# EAGLE schematic Preselector (EAGLE 7.7.0)

## Sheet 1 of 5: POWER SYSTEM
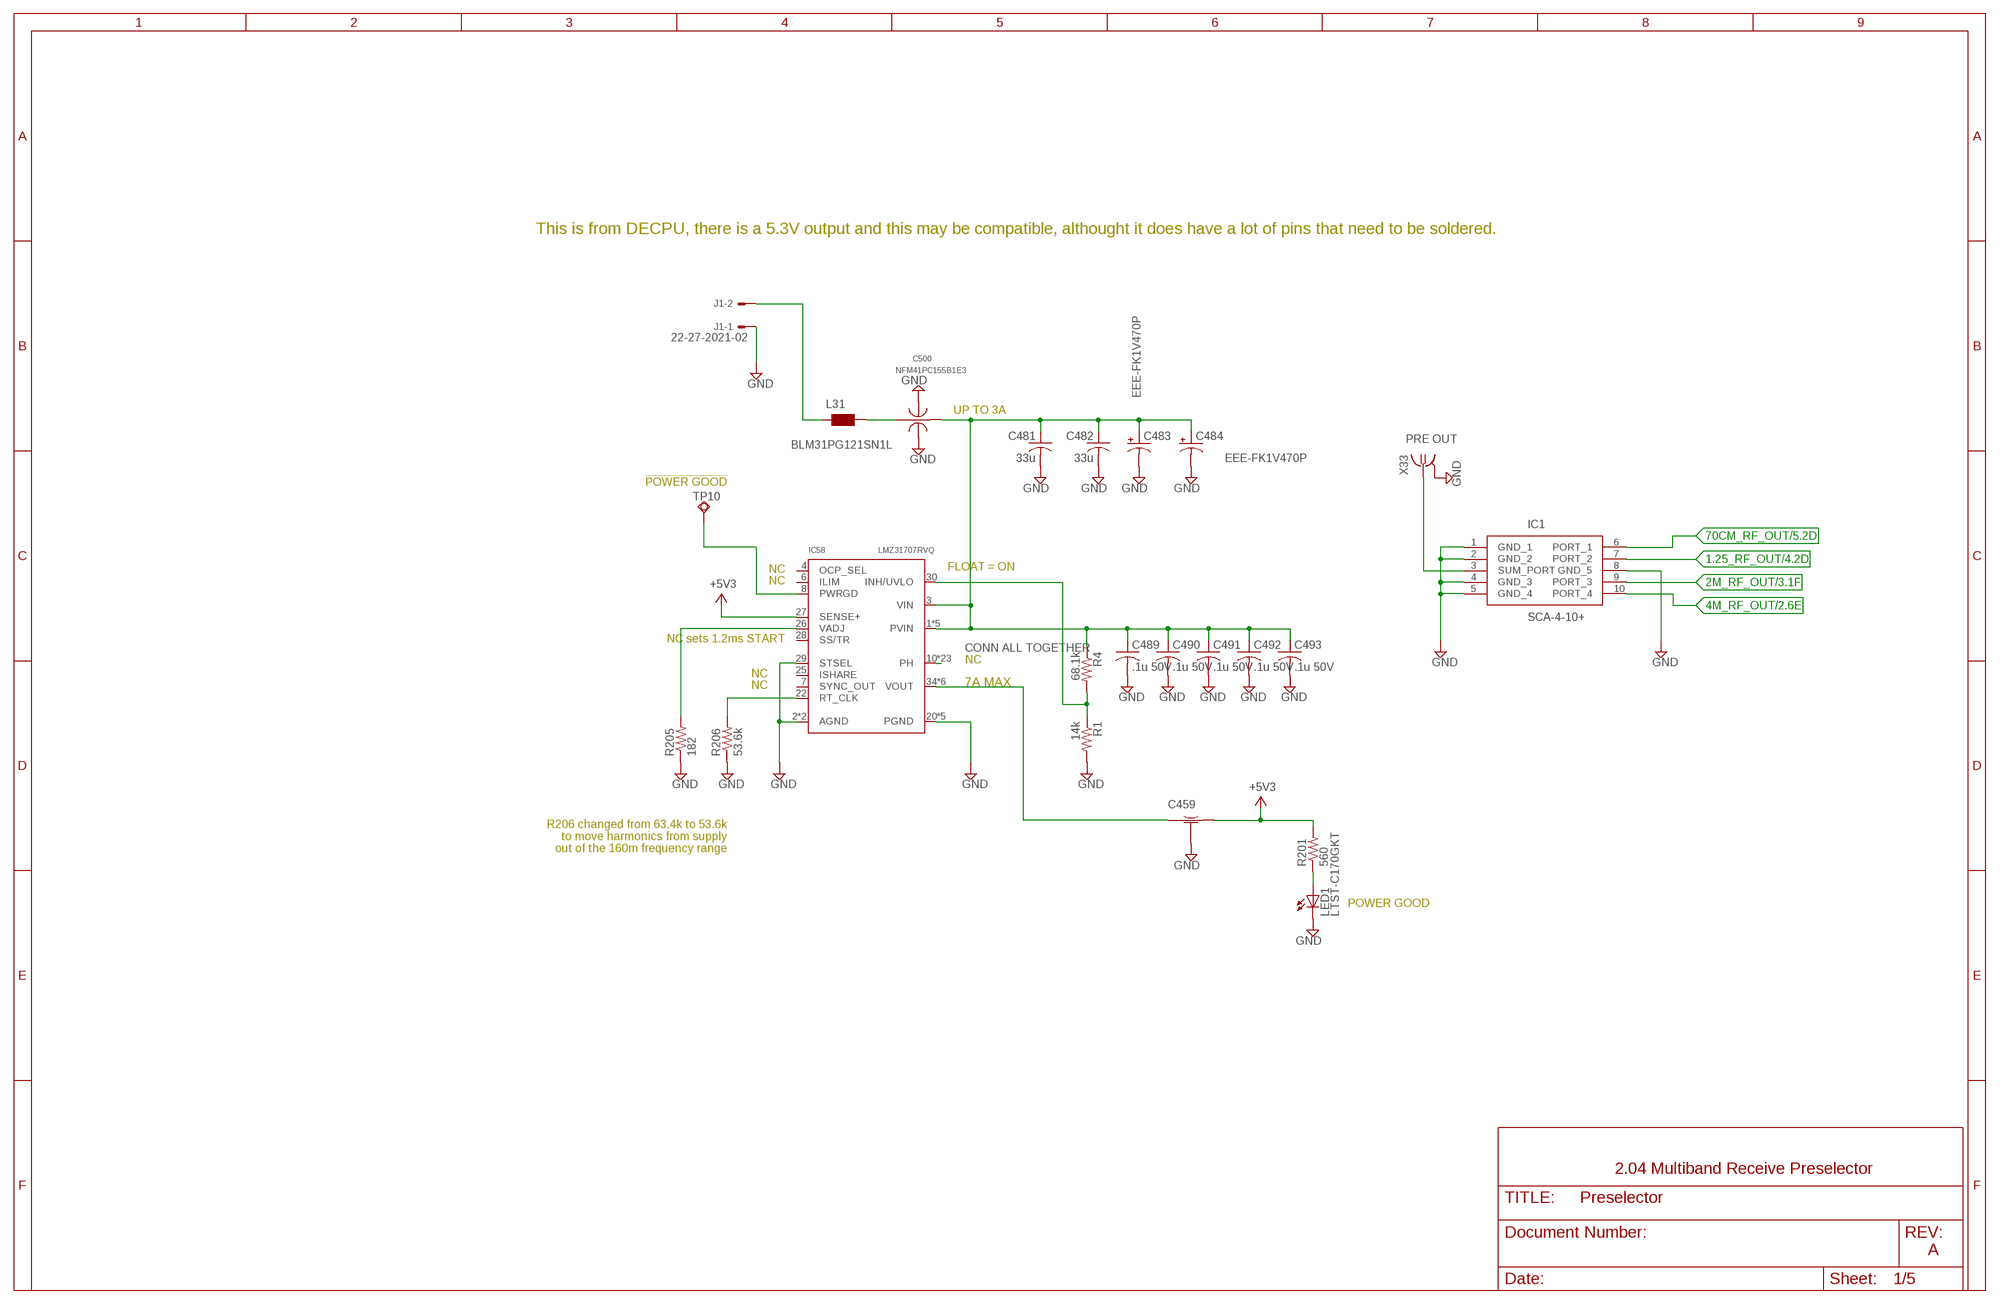
[diagram p0: schematic, sheet 1]

### Parts
C459  NFM31PC276B0J3L  [NFM31PC276]
C481  33u  C-USC1206K  [C1206K]
C482  33u  C-USC1206K  [C1206K]
C483  EEE-FK1V470P  CPOL-USD  [PANASONIC_D]
C484  EEE-FK1V470P  CPOL-USD  [PANASONIC_D]
C489  .1u 50V  C-USC0603K  [C0603K]
C490  .1u 50V  C-USC0603K  [C0603K]
C491  .1u 50V  C-USC0603K  [C0603K]
C492  .1u 50V  C-USC0603K  [C0603K]
C493  .1u 50V  C-USC0603K  [C0603K]
C500  NFM41PC155B1E3  [NFM1806]
IC1  SCA-4-10+  [SCA-4-10+]
IC58  LMZ31707RVQ  [RVQ]
J1  22-27-2021-02  [6410-02]
L31  BLM31PG121SN1L  WE-CBF_1206  [1206]
LED1  LTST-C170GKT  LEDCHIPLED_0805  [CHIPLED_0805]
R1  14k  R-US_R0603  [R0603]
R4  68.1k  R-US_R0603  [R0603]
R201  560  R-US_R0603  [R0603]
R205  182  R-US_R0603  [R0603]
R206  53.6k  R-US_R0603  [R0603]
TP10  TPSQB1,27  [B1,27]
X33  0733660061  BU-SMA-V  [BU-SMA-V]

### Nets
1.25_RF_OUT: IC1.7(PORT_2) ; also sheet 4
2M_RF_OUT: IC1.9(PORT_3) ; also sheet 3
4M_RF_OUT: IC1.10(PORT_4) ; also sheet 2
70CM_RF_OUT: IC1.6(PORT_1) ; also sheet 5
+5V3: C459.OUT IC58.27(SENSE+) R201.2 ; also sheet 2,3,4,5
+13.8V_SW_FIL: C481.1 C482.1 C483.+ C484.+ C489.1 C490.1 C491.1 C492.1 C493.1 C500.2(OUT) IC58.1(PVIN) IC58.3(VIN) IC58.11(PVIN) IC58.12(PVIN) IC58.39(PVIN) IC58.40(PVIN) R4.1
+13.8V_TPS: J1.2 L31.1
GND [GND]: C459.GND1(GND) C459.GND2(GND) C459.GND3(GND) C459.GND4(GND) C459.GND5(GND) C481.2 C482.2 C483.- C484.- C489.2 C490.2 C491.2 C492.2 C493.2 C500.GND@1(GND) C500.GND@2(GND) IC1.1(GND_1) IC1.2(GND_2) IC1.4(GND_3) IC1.5(GND_4) IC1.8(GND_5) IC58.2(AGND) IC58.20(PGND) IC58.21(PGND) IC58.23(AGND) IC58.29(STSEL) IC58.31(PGND) IC58.32(PGND) IC58.33(PGND) J1.1 LED1.C R1.2 R205.1 R206.1 X33.2(GND) ; also sheet 2,3,4,5
N$169: C500.1(IN) L31.2
N$178: IC58.30(INH/UVLO) R1.1 R4.2
N$180: IC58.8(PWRGD) TP10.TP
N$191: IC58.22(RT_CLK) R206.2
N$193: IC58.26(VADJ) R205.2
N$196: C459.IN IC58.34(VOUT) IC58.35(VOUT) IC58.36(VOUT) IC58.37(VOUT) IC58.38(VOUT) IC58.41(VOUT)
N$213: LED1.A R201.1
PH: IC58.10(PH) IC58.13(PH) IC58.14(PH) IC58.15(PH) IC58.16(PH) IC58.17(PH) IC58.18(PH) IC58.19(PH) IC58.42(PH) IC58.42A(PH) IC58.42B(PH) IC58.42C(PH) IC58.42D(PH) IC58.42E(PH) IC58.42F(PH) IC58.42G(PH) IC58.42H(PH) IC58.42J(PH) IC58.42K(PH) IC58.42L(PH) IC58.42M(PH) IC58.42N(PH) IC58.42P(PH)
PRE_OUT: IC1.3(SUM_PORT) X33.1
Unconnected: IC58.4(OCP_SEL) IC58.6(ILIM) IC58.7(SYNC_OUT) IC58.25(ISHARE) IC58.28(SS/TR)

### Notes on the sheet
- This is from DECPU, there is a 5.3V output and this may be compatible, althought it does have a lot of pins that need to be soldered.
- UP TO 3A
- PRE OUT
- !POWER GOOD
- NC
- FLOAT = ON
- NC
- NC sets 1.2ms START
- CONN ALL TOGETHER
- NC
- NC
- NC
- 7A MAX
- R206 changed from 63.4k to 53.6k
  to move harmonics from supply
  out of the 160m frequency range
- POWER GOOD
- 2.04 Multiband Receive Preselector
- A

## Sheet 2 of 5: 4m Band
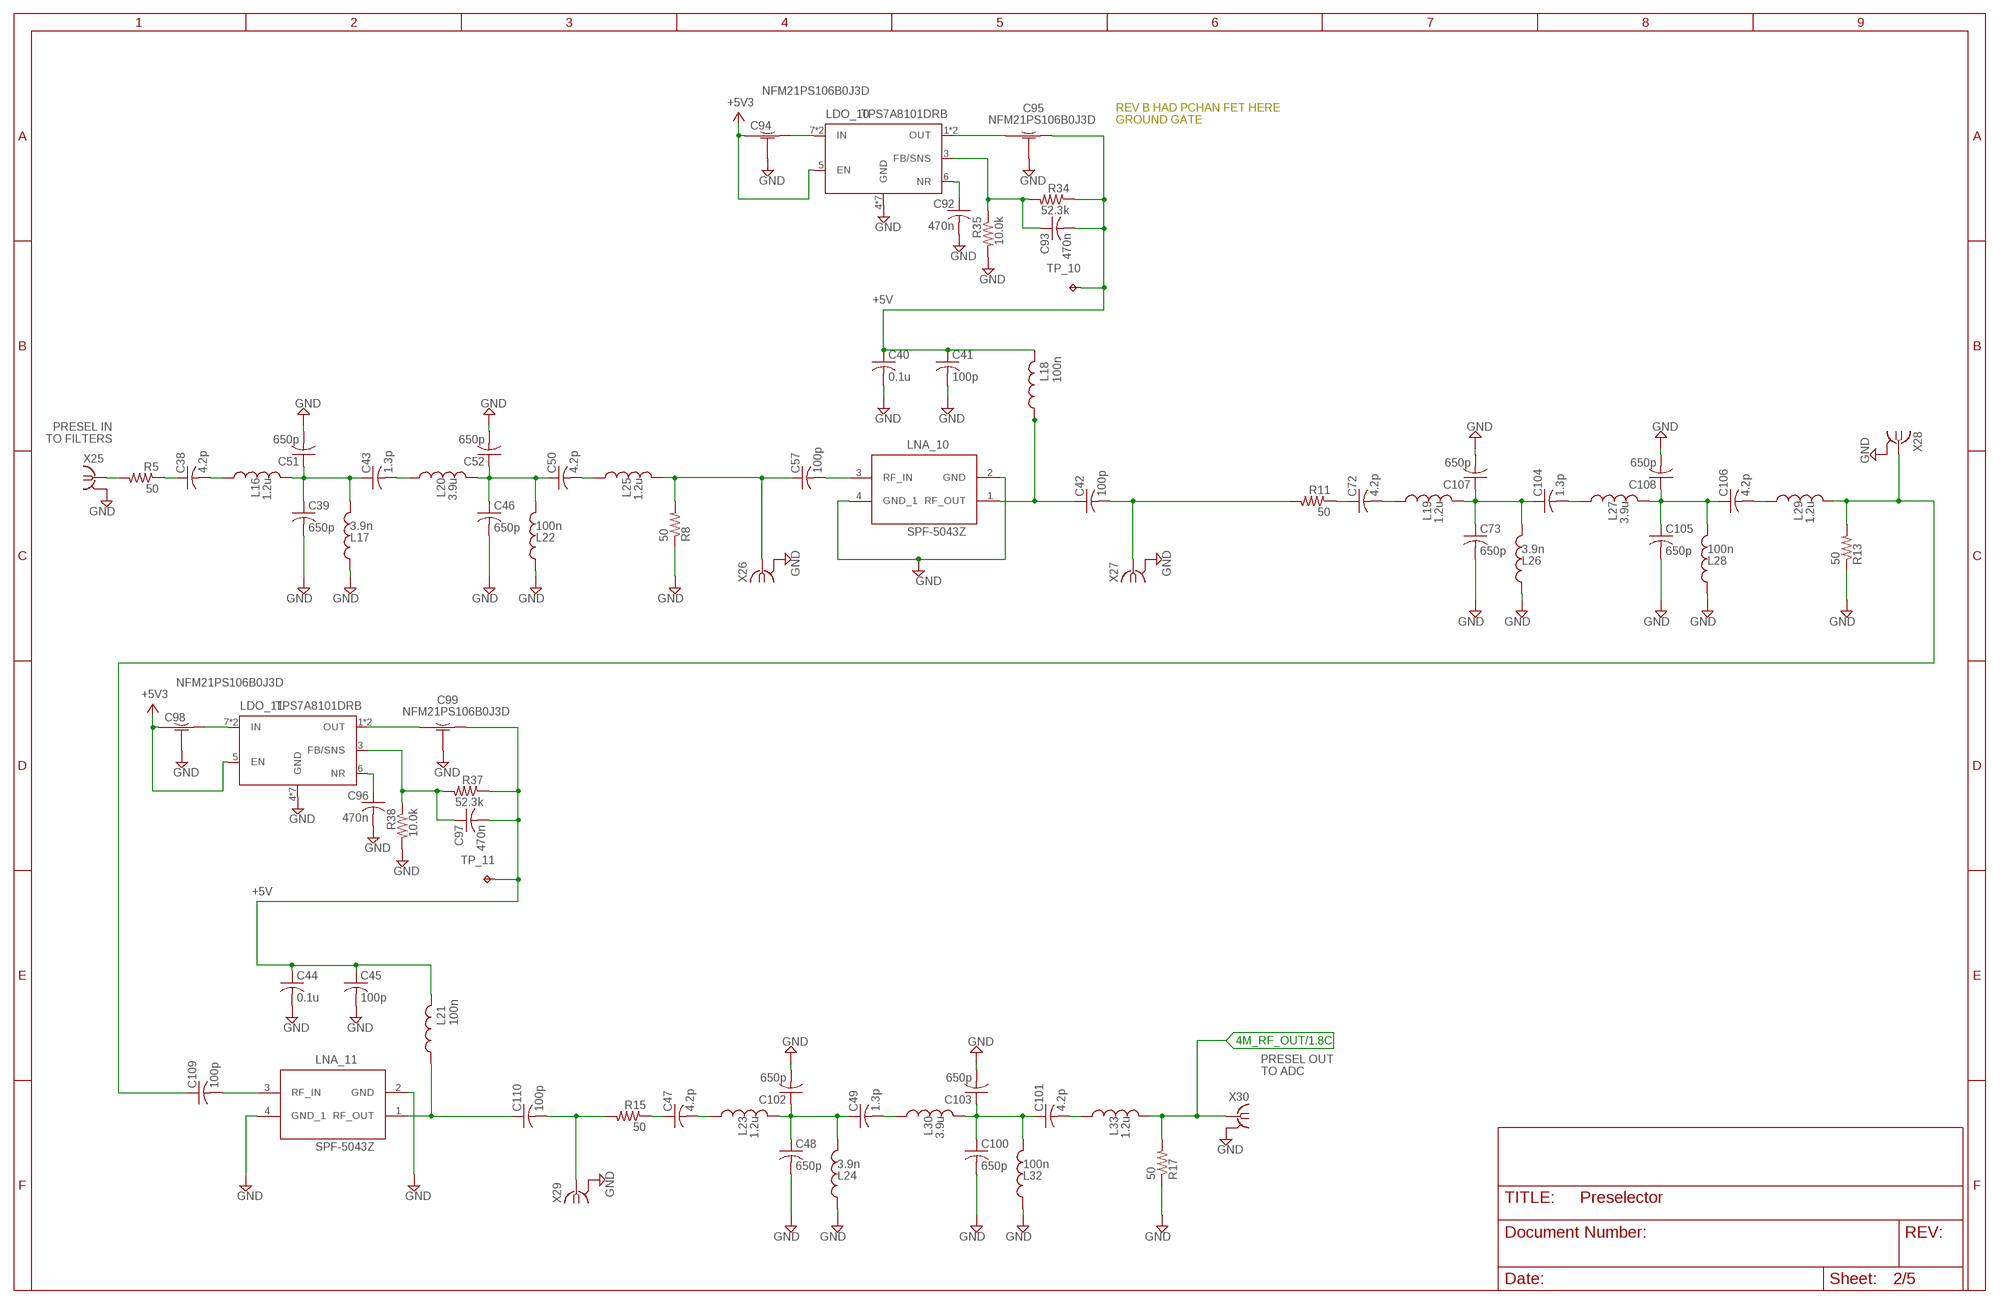
[diagram p1: schematic, sheet 2]

### Parts
C38  4.2p  C-USC0603K  [C0603K]
C39  650p  C-USC0603K  [C0603K]
C40  0.1u  C-USC0603K  [C0603K]
C41  100p  C-USC0603K  [C0603K]
C42  100p  C-USC0603K  [C0603K]
C43  1.3p  C-USC0603K  [C0603K]
C44  0.1u  C-USC0603K  [C0603K]
C45  100p  C-USC0603K  [C0603K]
C46  650p  C-USC0603K  [C0603K]
C47  4.2p  C-USC0603K  [C0603K]
C48  650p  C-USC0603K  [C0603K]
C49  1.3p  C-USC0603K  [C0603K]
C50  4.2p  C-USC0603K  [C0603K]
C51  650p  C-USC0603K  [C0603K]
C52  650p  C-USC0603K  [C0603K]
C57  100p  C-USC0603K  [C0603K]
C72  4.2p  C-USC0603K  [C0603K]
C73  650p  C-USC0603K  [C0603K]
C92  470n  C-USC0603K  [C0603K]
C93  470n  C-USC0603K  [C0603K]
C94  NFM21PS106B0J3D  NFM21PS  [NFM21PS]
C95  NFM21PS106B0J3D  NFM21PS  [NFM21PS]
C96  470n  C-USC0603K  [C0603K]
C97  470n  C-USC0603K  [C0603K]
C98  NFM21PS106B0J3D  NFM21PS  [NFM21PS]
C99  NFM21PS106B0J3D  NFM21PS  [NFM21PS]
C100  650p  C-USC0603K  [C0603K]
C101  4.2p  C-USC0603K  [C0603K]
C102  650p  C-USC0603K  [C0603K]
C103  650p  C-USC0603K  [C0603K]
C104  1.3p  C-USC0603K  [C0603K]
C105  650p  C-USC0603K  [C0603K]
C106  4.2p  C-USC0603K  [C0603K]
C107  650p  C-USC0603K  [C0603K]
C108  650p  C-USC0603K  [C0603K]
C109  100p  C-USC0603K  [C0603K]
C110  100p  C-USC0603K  [C0603K]
L16  1.2u  L-US0603  [C0603K]
L17  3.9n  L-US0603  [C0603K]
L18  100n  L-US1206  [C1206]
L19  1.2u  L-US0603  [C0603K]
L20  3.9u  L-US0603  [C0603K]
L21  100n  L-US1206  [C1206]
L22  100n  L-US0603  [C0603K]
L23  1.2u  L-US0603  [C0603K]
L24  3.9n  L-US0603  [C0603K]
L25  1.2u  L-US0603  [C0603K]
L26  3.9n  L-US0603  [C0603K]
L27  3.9u  L-US0603  [C0603K]
L28  100n  L-US0603  [C0603K]
L29  1.2u  L-US0603  [C0603K]
L30  3.9u  L-US0603  [C0603K]
L32  100n  L-US0603  [C0603K]
L33  1.2u  L-US0603  [C0603K]
LDO_10  TPS7A8101DRB  [DRB]
LDO_11  TPS7A8101DRB  [DRB]
LNA_10  SPF-5043Z  [SPF-5043Z]
LNA_11  SPF-5043Z  [SPF-5043Z]
R5  50  R-US_R0603  [R0603]
R8  50  R-US_R0603  [R0603]
R11  50  R-US_R0603  [R0603]
R13  50  R-US_R0603  [R0603]
R15  50  R-US_R0603  [R0603]
R17  50  R-US_R0603  [R0603]
R34  52.3k  R-US_R0603  [R0603]
R35  10.0k  R-US_R0603  [R0603]
R37  52.3k  R-US_R0603  [R0603]
R38  10.0k  R-US_R0603  [R0603]
TP_10  TPTP20SQ  [TP20SQ]
TP_11  TPTP20SQ  [TP20SQ]
X25  0733660061  BU-SMA-V  [BU-SMA-V]
X26  0733660061  BU-SMA-V  [BU-SMA-V]
X27  0733660061  BU-SMA-V  [BU-SMA-V]
X28  0733660061  BU-SMA-V  [BU-SMA-V]
X29  0733660061  BU-SMA-V  [BU-SMA-V]
X30  0733660061  BU-SMA-V  [BU-SMA-V]

### Nets
4M_RF_OUT: L33.2 R17.2 X30.1 ; also sheet 1
+5V3: C94.IN C98.IN LDO_10.5(EN) LDO_11.5(EN) ; also sheet 1,3,4,5
GND [GND]: C39.2 C40.2 C41.2 C44.2 C45.2 C46.2 C48.2 C51.2 C52.2 C73.2 C92.2 C94.GND1(GND) C94.GND2(GND) C94.GND3(GND) C94.GND4(GND) C94.GND5(GND) C94.GND6(GND) C94.GND7(GND) C94.GND8(GND) C95.GND1(GND) C95.GND2(GND) C95.GND3(GND) C95.GND4(GND) C95.GND5(GND) C95.GND6(GND) C95.GND7(GND) C95.GND8(GND) C96.2 C98.GND1(GND) C98.GND2(GND) C98.GND3(GND) C98.GND4(GND) C98.GND5(GND) C98.GND6(GND) C98.GND7(GND) C98.GND8(GND) C99.GND1(GND) C99.GND2(GND) C99.GND3(GND) C99.GND4(GND) C99.GND5(GND) C99.GND6(GND) C99.GND7(GND) C99.GND8(GND) C100.2 C102.2 C103.2 C105.2 C107.2 C108.2 L17.1 L22.1 L24.1 L26.1 L28.1 L32.1 LDO_10.4(GND) LDO_10.P1(GND) LDO_10.P2(GND) LDO_10.P3(GND) LDO_10.P4(GND) LDO_10.P5(GND) LDO_10.PAD(GND) LDO_11.4(GND) LDO_11.P1(GND) LDO_11.P2(GND) LDO_11.P3(GND) LDO_11.P4(GND) LDO_11.P5(GND) LDO_11.PAD(GND) LNA_10.2(GND) LNA_10.4(GND_1) LNA_11.2(GND) LNA_11.4(GND_1) R8.1 R13.1 R17.1 R35.2 R38.2 X25.2(GND) X26.2(GND) X27.2(GND) X28.2(GND) X29.2(GND) X30.2(GND) ; also sheet 1,3,4,5
LDO_10_5V: C40.1 C41.1 C93.2 C95.OUT L18.2 R34.1 TP_10.TP
LDO_11_5V: C44.1 C45.1 C97.2 C99.OUT L21.2 R37.1 TP_11.TP
LNA_10_IN: C57.1 L25.2 R8.2 X26.1
LNA_10_IN1: C109.1 L29.2 R13.2 X28.1
LNA_10_OUT: C42.1 L18.1 LNA_10.1(RF_OUT)
LNA_11_OUT: C110.1 L21.1 LNA_11.1(RF_OUT)
N$2: R5.2 X25.1
N$3: C38.1 R5.1
N$4: C38.2 L16.1
N$6: C39.1 C43.1 C51.1 L16.2 L17.2
N$7: C43.2 L20.1
N$9: C46.1 C50.1 C52.1 L20.2 L22.2
N$10: C50.2 L25.1
N$11: C57.2 LNA_10.3(RF_IN)
N$61: C93.1 LDO_10.3(FB/SNS) R34.2 R35.1
N$62: C92.1 LDO_10.6(NR)
N$63: C94.OUT LDO_10.7(IN) LDO_10.8(IN)
N$64: C95.IN LDO_10.1(OUT) LDO_10.2(OUT)
N$65: C72.1 R11.1
N$66: C97.1 LDO_11.3(FB/SNS) R37.2 R38.1
N$67: C96.1 LDO_11.6(NR)
N$68: C98.OUT LDO_11.7(IN) LDO_11.8(IN)
N$69: C99.IN LDO_11.1(OUT) LDO_11.2(OUT)
N$70: C47.1 R15.1
N$71: C47.2 L23.1
N$72: C48.1 C49.1 C102.1 L23.2 L24.2
N$73: C49.2 L30.1
N$74: C72.2 L19.1
N$75: C73.1 C104.1 C107.1 L19.2 L26.2
N$76: C104.2 L27.1
N$77: C105.1 C106.1 C108.1 L27.2 L28.2
N$78: C106.2 L29.1
N$79: C100.1 C101.1 C103.1 L30.2 L32.2
N$80: C101.2 L33.1
N$81: C109.2 LNA_11.3(RF_IN)
N$82: C110.2 R15.2 X29.1
SAW_14_IN: C42.2 R11.2 X27.1

### Notes on the sheet
- REV B HAD PCHAN FET HERE
  GROUND GATE
- +5V
- PRESEL IN
  TO FILTERS
- +5V
- PRESEL OUT
  TO ADC

## Sheet 3 of 5: 2m Band
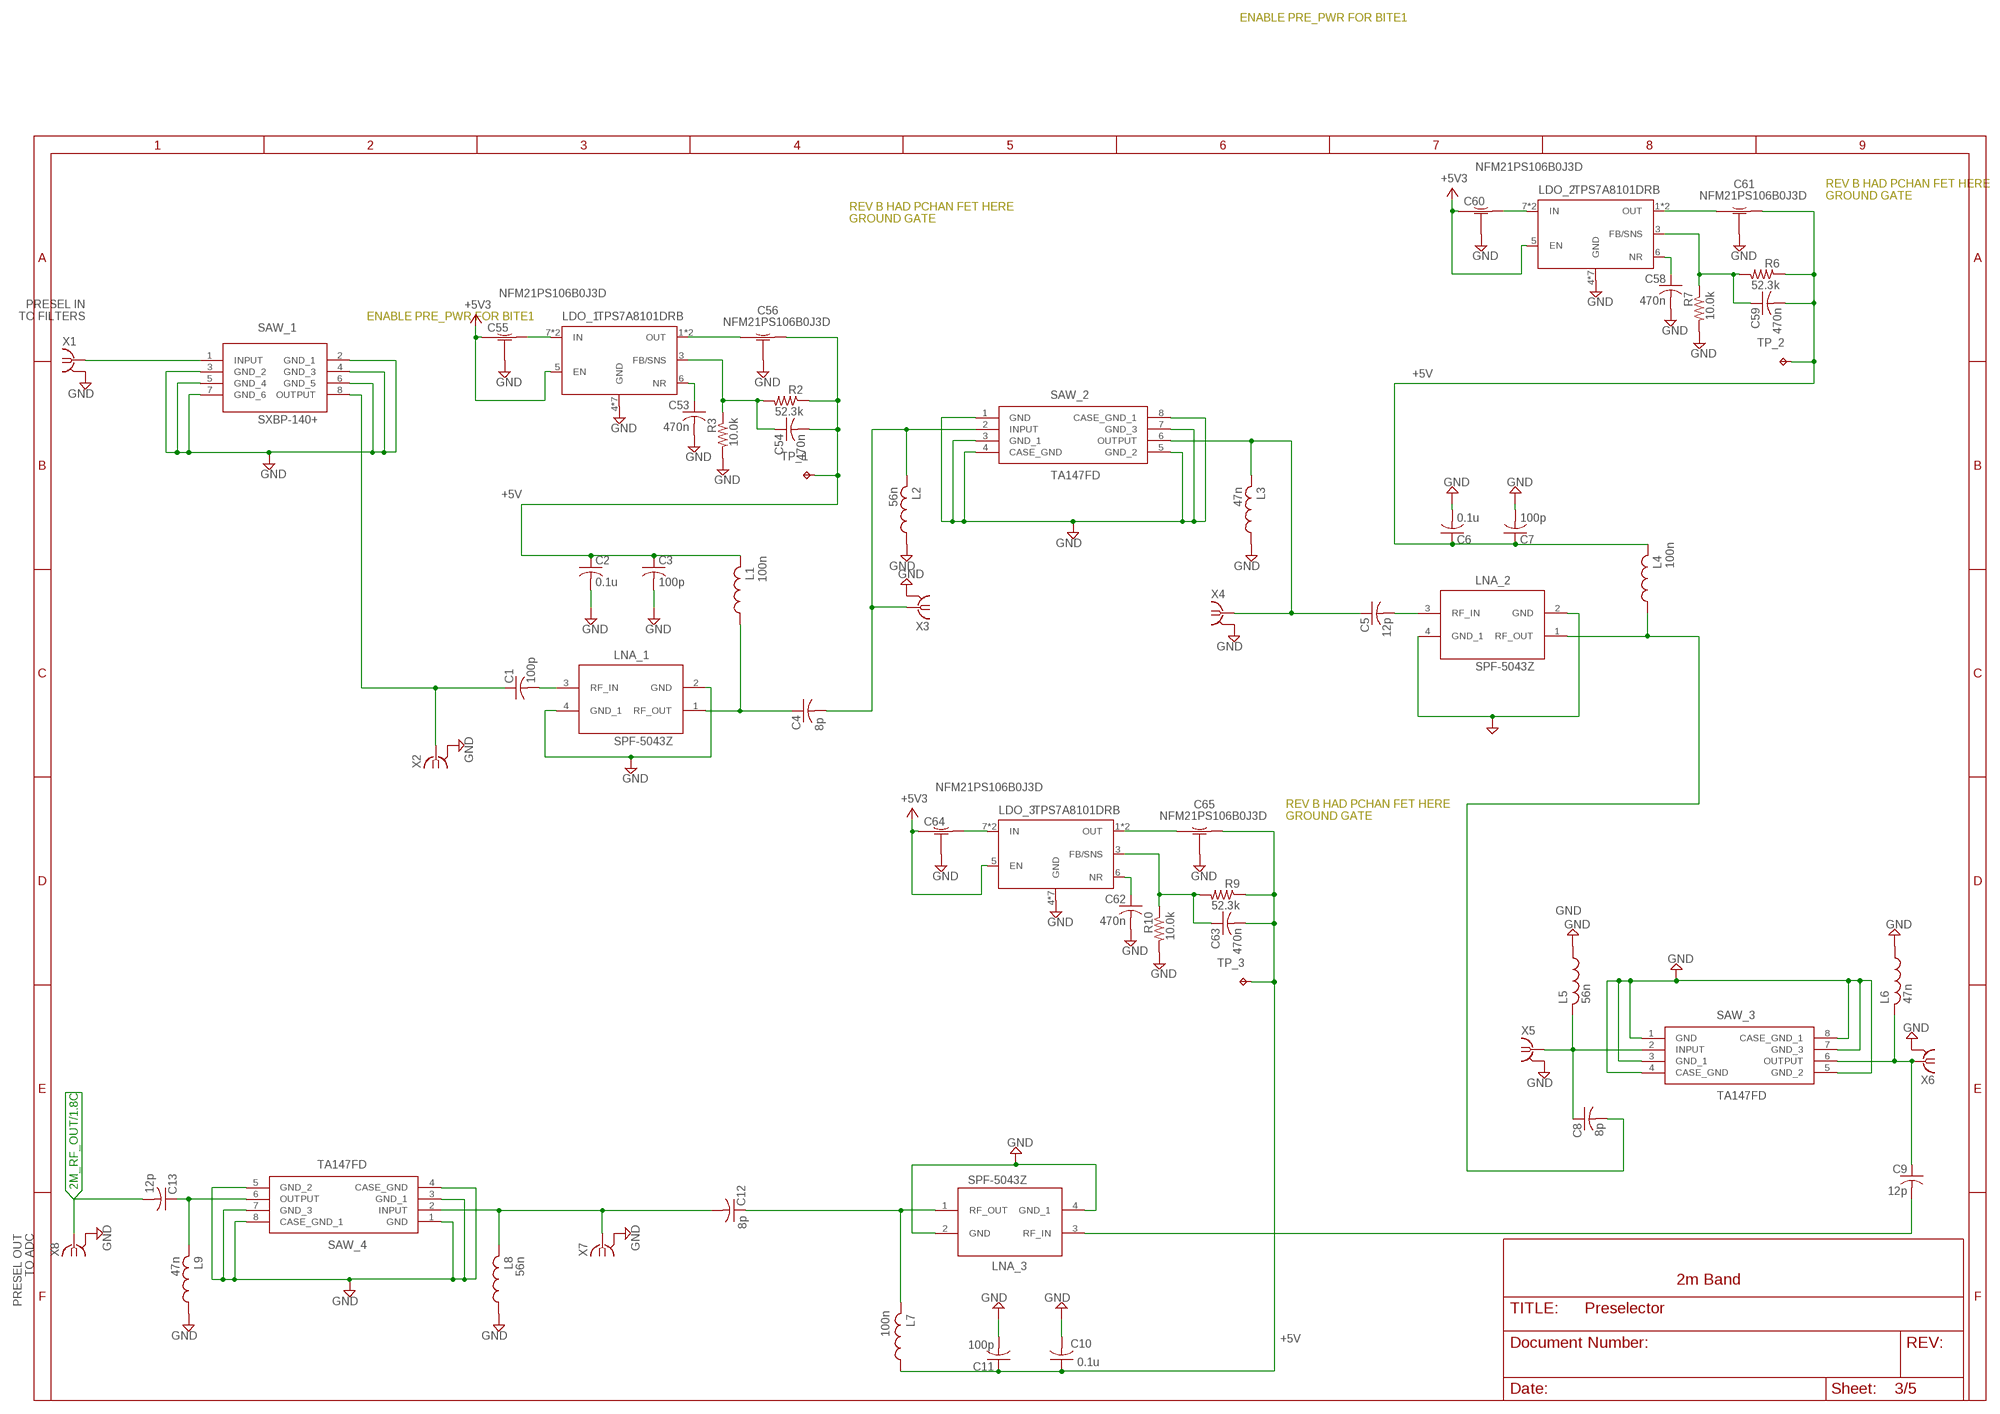
[diagram p2: schematic, sheet 3]

### Parts
C1  100p  C-USC0603K  [C0603K]
C2  0.1u  C-USC0603K  [C0603K]
C3  100p  C-USC0603K  [C0603K]
C4  8p  C-USC0603K  [C0603K]
C5  12p  C-USC0603K  [C0603K]
C6  0.1u  C-USC0603K  [C0603K]
C7  100p  C-USC0603K  [C0603K]
C8  8p  C-USC0603K  [C0603K]
C9  12p  C-USC0603K  [C0603K]
C10  0.1u  C-USC0603K  [C0603K]
C11  100p  C-USC0603K  [C0603K]
C12  8p  C-USC0603K  [C0603K]
C13  12p  C-USC0603K  [C0603K]
C53  470n  C-USC0603K  [C0603K]
C54  470n  C-USC0603K  [C0603K]
C55  NFM21PS106B0J3D  NFM21PS  [NFM21PS]
C56  NFM21PS106B0J3D  NFM21PS  [NFM21PS]
C58  470n  C-USC0603K  [C0603K]
C59  470n  C-USC0603K  [C0603K]
C60  NFM21PS106B0J3D  NFM21PS  [NFM21PS]
C61  NFM21PS106B0J3D  NFM21PS  [NFM21PS]
C62  470n  C-USC0603K  [C0603K]
C63  470n  C-USC0603K  [C0603K]
C64  NFM21PS106B0J3D  NFM21PS  [NFM21PS]
C65  NFM21PS106B0J3D  NFM21PS  [NFM21PS]
L1  100n  L-US1206  [C1206]
L2  56n  L-US1206  [C1206]
L3  47n  L-US1206  [C1206]
L4  100n  L-US1206  [C1206]
L5  56n  L-US1206  [C1206]
L6  47n  L-US1206  [C1206]
L7  100n  L-US1206  [C1206]
L8  56n  L-US1206  [C1206]
L9  47n  L-US1206  [C1206]
LDO_1  TPS7A8101DRB  [DRB]
LDO_2  TPS7A8101DRB  [DRB]
LDO_3  TPS7A8101DRB  [DRB]
LNA_1  SPF-5043Z  [SPF-5043Z]
LNA_2  SPF-5043Z  [SPF-5043Z]
LNA_3  SPF-5043Z  [SPF-5043Z]
R2  52.3k  R-US_R0603  [R0603]
R3  10.0k  R-US_R0603  [R0603]
R6  52.3k  R-US_R0603  [R0603]
R7  10.0k  R-US_R0603  [R0603]
R9  52.3k  R-US_R0603  [R0603]
R10  10.0k  R-US_R0603  [R0603]
SAW_1  SXBP-140+  [SXBP-140+]
SAW_2  TA147FD  [TA147FD]
SAW_3  TA147FD  [TA147FD]
SAW_4  TA147FD  [TA147FD]
TP_1  TPTP20SQ  [TP20SQ]
TP_2  TPTP20SQ  [TP20SQ]
TP_3  TPTP20SQ  [TP20SQ]
X1  0733660061  BU-SMA-V  [BU-SMA-V]
X2  0733660061  BU-SMA-V  [BU-SMA-V]
X3  0733660061  BU-SMA-V  [BU-SMA-V]
X4  0733660061  BU-SMA-V  [BU-SMA-V]
X5  0733660061  BU-SMA-V  [BU-SMA-V]
X6  0733660061  BU-SMA-V  [BU-SMA-V]
X7  0733660061  BU-SMA-V  [BU-SMA-V]
X8  0733660061  BU-SMA-V  [BU-SMA-V]

### Nets
2M_RF_IN: SAW_1.1(INPUT) X1.1
2M_RF_OUT: C13.2 X8.1 ; also sheet 1
+5V3: C55.IN C60.IN C64.IN LDO_1.5(EN) LDO_2.5(EN) LDO_3.5(EN) ; also sheet 1,2,4,5
GND [GND]: C2.2 C3.2 C6.2 C7.2 C10.2 C11.2 C53.2 C55.GND1(GND) C55.GND2(GND) C55.GND3(GND) C55.GND4(GND) C55.GND5(GND) C55.GND6(GND) C55.GND7(GND) C55.GND8(GND) C56.GND1(GND) C56.GND2(GND) C56.GND3(GND) C56.GND4(GND) C56.GND5(GND) C56.GND6(GND) C56.GND7(GND) C56.GND8(GND) C58.2 C60.GND1(GND) C60.GND2(GND) C60.GND3(GND) C60.GND4(GND) C60.GND5(GND) C60.GND6(GND) C60.GND7(GND) C60.GND8(GND) C61.GND1(GND) C61.GND2(GND) C61.GND3(GND) C61.GND4(GND) C61.GND5(GND) C61.GND6(GND) C61.GND7(GND) C61.GND8(GND) C62.2 C64.GND1(GND) C64.GND2(GND) C64.GND3(GND) C64.GND4(GND) C64.GND5(GND) C64.GND6(GND) C64.GND7(GND) C64.GND8(GND) C65.GND1(GND) C65.GND2(GND) C65.GND3(GND) C65.GND4(GND) C65.GND5(GND) C65.GND6(GND) C65.GND7(GND) C65.GND8(GND) L2.1 L3.1 L5.1 L6.1 L8.1 L9.1 LDO_1.4(GND) LDO_1.P1(GND) LDO_1.P2(GND) LDO_1.P3(GND) LDO_1.P4(GND) LDO_1.P5(GND) LDO_1.PAD(GND) LDO_2.4(GND) LDO_2.P1(GND) LDO_2.P2(GND) LDO_2.P3(GND) LDO_2.P4(GND) LDO_2.P5(GND) LDO_2.PAD(GND) LDO_3.4(GND) LDO_3.P1(GND) LDO_3.P2(GND) LDO_3.P3(GND) LDO_3.P4(GND) LDO_3.P5(GND) LDO_3.PAD(GND) LNA_1.2(GND) LNA_1.4(GND_1) LNA_2.2(GND) LNA_2.4(GND_1) LNA_3.2(GND) LNA_3.4(GND_1) R3.2 R7.2 R10.2 SAW_1.2(GND_1) SAW_1.3(GND_2) SAW_1.4(GND_3) SAW_1.5(GND_4) SAW_1.6(GND_5) SAW_1.7(GND_6) SAW_2.1(GND) SAW_2.3(GND_1) SAW_2.4(CASE_GND) SAW_2.5(GND_2) SAW_2.7(GND_3) SAW_2.8(CASE_GND_1) SAW_3.1(GND) SAW_3.3(GND_1) SAW_3.4(CASE_GND) SAW_3.5(GND_2) SAW_3.7(GND_3) SAW_3.8(CASE_GND_1) SAW_4.1(GND) SAW_4.3(GND_1) SAW_4.4(CASE_GND) SAW_4.5(GND_2) SAW_4.7(GND_3) SAW_4.8(CASE_GND_1) X1.2(GND) X2.2(GND) X3.2(GND) X4.2(GND) X5.2(GND) X6.2(GND) X7.2(GND) X8.2(GND) ; also sheet 1,2,4,5
LDO_1_5V: C2.1 C3.1 C54.2 C56.OUT L1.2 R2.1 TP_1.TP
LDO_2_5V: C6.1 C7.1 C59.2 C61.OUT L4.2 R6.1 TP_2.TP
LDO_3_5V: C10.1 C11.1 C63.2 C65.OUT L7.1 R9.1 TP_3.TP
LNA_1_IN: C1.2 LNA_1.3(RF_IN)
LNA_1_OUT: C4.1 L1.1 LNA_1.1(RF_OUT)
LNA_2_IN: C5.2 LNA_2.3(RF_IN)
LNA_2_OUT: C8.2 L4.1 LNA_2.1(RF_OUT)
LNA_3_IN: C9.2 LNA_3.3(RF_IN)
LNA_3_OUT: C12.1 L7.2 LNA_3.1(RF_OUT)
N$12: C54.1 LDO_1.3(FB/SNS) R2.2 R3.1
N$13: C53.1 LDO_1.6(NR)
N$14: C55.OUT LDO_1.7(IN) LDO_1.8(IN)
N$15: C56.IN LDO_1.1(OUT) LDO_1.2(OUT)
N$16: C59.1 LDO_2.3(FB/SNS) R6.2 R7.1
N$17: C58.1 LDO_2.6(NR)
N$18: C60.OUT LDO_2.7(IN) LDO_2.8(IN)
N$19: C61.IN LDO_2.1(OUT) LDO_2.2(OUT)
N$20: C63.1 LDO_3.3(FB/SNS) R9.2 R10.1
N$22: C62.1 LDO_3.6(NR)
N$24: C64.OUT LDO_3.7(IN) LDO_3.8(IN)
N$25: C65.IN LDO_3.1(OUT) LDO_3.2(OUT)
SAW_1_OUT: C1.1 SAW_1.8(OUTPUT) X2.1
SAW_2_IN [GND]: C4.2 L2.2 SAW_2.2(INPUT) X3.1
SAW_2_OUT: C5.1 L3.2 SAW_2.6(OUTPUT) X4.1
SAW_3_IN: C8.1 L5.2 SAW_3.2(INPUT) X5.1
SAW_3_OUT: C9.1 L6.2 SAW_3.6(OUTPUT) X6.1
SAW_4_IN: C12.2 L8.2 SAW_4.2(INPUT) X7.1
SAW_4_OUT: C13.1 L9.2 SAW_4.6(OUTPUT)

### Notes on the sheet
- ENABLE PRE_PWR FOR BITE1
- REV B HAD PCHAN FET HERE
  GROUND GATE
- REV B HAD PCHAN FET HERE
  GROUND GATE
- PRESEL IN
  TO FILTERS
- ENABLE PRE_PWR FOR BITE1
- +5V
- +5V
- REV B HAD PCHAN FET HERE
  GROUND GATE
- PRESEL OUT
  TO ADC
- 2m Band
- +5V

## Sheet 4 of 5: 1.25m Band
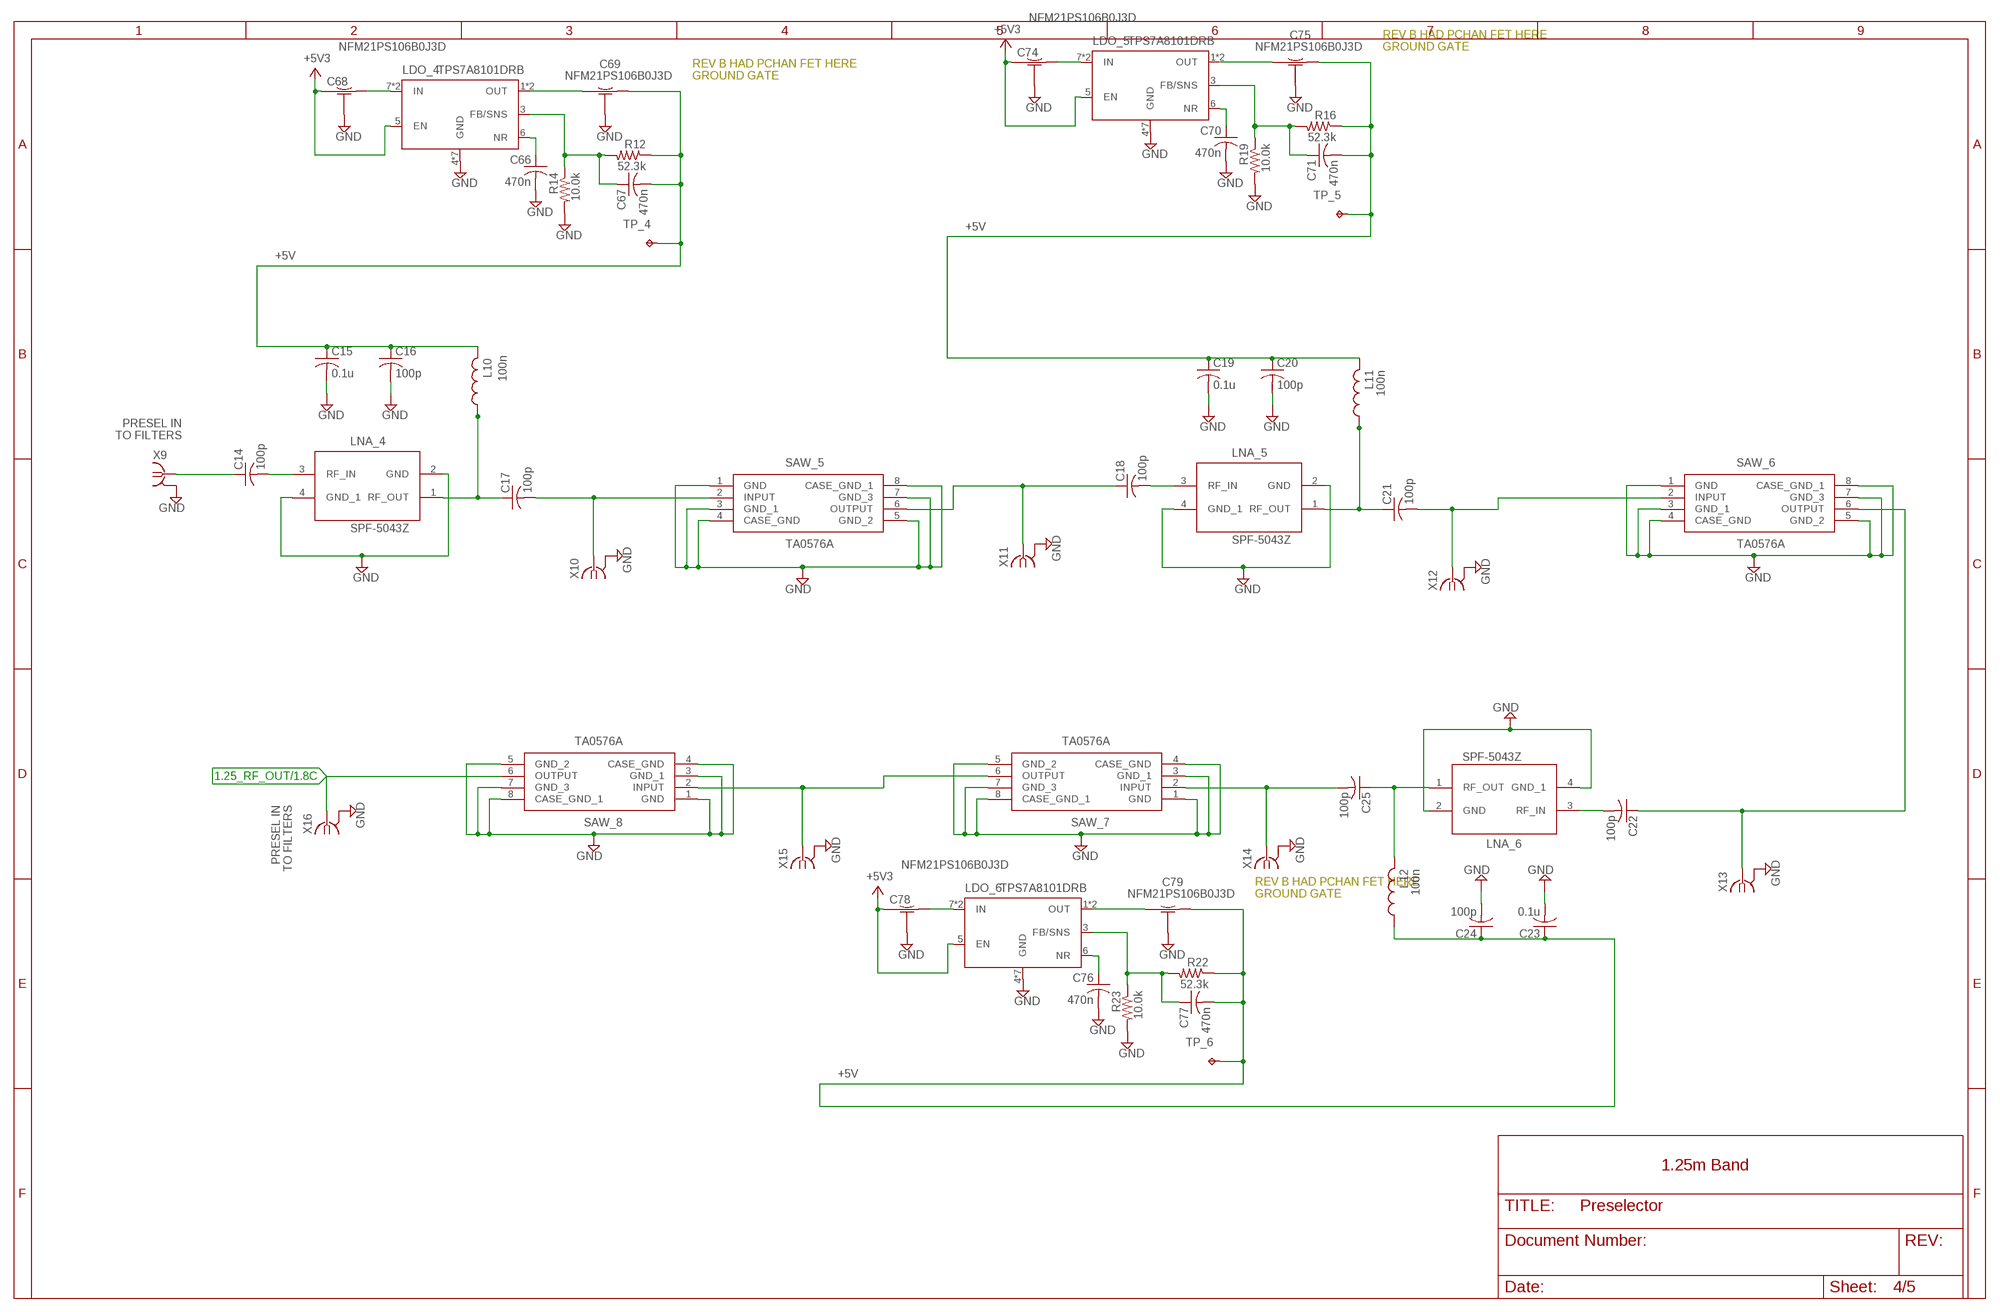
[diagram p3: schematic, sheet 4]

### Parts
C14  100p  C-USC0603K  [C0603K]
C15  0.1u  C-USC0603K  [C0603K]
C16  100p  C-USC0603K  [C0603K]
C17  100p  C-USC0603K  [C0603K]
C18  100p  C-USC0603K  [C0603K]
C19  0.1u  C-USC0603K  [C0603K]
C20  100p  C-USC0603K  [C0603K]
C21  100p  C-USC0603K  [C0603K]
C22  100p  C-USC0603K  [C0603K]
C23  0.1u  C-USC0603K  [C0603K]
C24  100p  C-USC0603K  [C0603K]
C25  100p  C-USC0603K  [C0603K]
C66  470n  C-USC0603K  [C0603K]
C67  470n  C-USC0603K  [C0603K]
C68  NFM21PS106B0J3D  NFM21PS  [NFM21PS]
C69  NFM21PS106B0J3D  NFM21PS  [NFM21PS]
C70  470n  C-USC0603K  [C0603K]
C71  470n  C-USC0603K  [C0603K]
C74  NFM21PS106B0J3D  NFM21PS  [NFM21PS]
C75  NFM21PS106B0J3D  NFM21PS  [NFM21PS]
C76  470n  C-USC0603K  [C0603K]
C77  470n  C-USC0603K  [C0603K]
C78  NFM21PS106B0J3D  NFM21PS  [NFM21PS]
C79  NFM21PS106B0J3D  NFM21PS  [NFM21PS]
L10  100n  L-US1206  [C1206]
L11  100n  L-US1206  [C1206]
L12  100n  L-US1206  [C1206]
LDO_4  TPS7A8101DRB  [DRB]
LDO_5  TPS7A8101DRB  [DRB]
LDO_6  TPS7A8101DRB  [DRB]
LNA_4  SPF-5043Z  [SPF-5043Z]
LNA_5  SPF-5043Z  [SPF-5043Z]
LNA_6  SPF-5043Z  [SPF-5043Z]
R12  52.3k  R-US_R0603  [R0603]
R14  10.0k  R-US_R0603  [R0603]
R16  52.3k  R-US_R0603  [R0603]
R19  10.0k  R-US_R0603  [R0603]
R22  52.3k  R-US_R0603  [R0603]
R23  10.0k  R-US_R0603  [R0603]
SAW_5  TA0576A  [TA0576A]
SAW_6  TA0576A  [TA0576A]
SAW_7  TA0576A  [TA0576A]
SAW_8  TA0576A  [TA0576A]
TP_4  TPTP20SQ  [TP20SQ]
TP_5  TPTP20SQ  [TP20SQ]
TP_6  TPTP20SQ  [TP20SQ]
X9  0733660061  BU-SMA-V  [BU-SMA-V]
X10  0733660061  BU-SMA-V  [BU-SMA-V]
X11  0733660061  BU-SMA-V  [BU-SMA-V]
X12  0733660061  BU-SMA-V  [BU-SMA-V]
X13  0733660061  BU-SMA-V  [BU-SMA-V]
X14  0733660061  BU-SMA-V  [BU-SMA-V]
X15  0733660061  BU-SMA-V  [BU-SMA-V]
X16  0733660061  BU-SMA-V  [BU-SMA-V]

### Nets
1.25_RF_OUT: SAW_8.6(OUTPUT) X16.1 ; also sheet 1
1.25M_RF_IN: C14.1 X9.1
+5V3: C68.IN C74.IN C78.IN LDO_4.5(EN) LDO_5.5(EN) LDO_6.5(EN) ; also sheet 1,2,3,5
GND [GND]: C15.2 C16.2 C19.2 C20.2 C23.2 C24.2 C66.2 C68.GND1(GND) C68.GND2(GND) C68.GND3(GND) C68.GND4(GND) C68.GND5(GND) C68.GND6(GND) C68.GND7(GND) C68.GND8(GND) C69.GND1(GND) C69.GND2(GND) C69.GND3(GND) C69.GND4(GND) C69.GND5(GND) C69.GND6(GND) C69.GND7(GND) C69.GND8(GND) C70.2 C74.GND1(GND) C74.GND2(GND) C74.GND3(GND) C74.GND4(GND) C74.GND5(GND) C74.GND6(GND) C74.GND7(GND) C74.GND8(GND) C75.GND1(GND) C75.GND2(GND) C75.GND3(GND) C75.GND4(GND) C75.GND5(GND) C75.GND6(GND) C75.GND7(GND) C75.GND8(GND) C76.2 C78.GND1(GND) C78.GND2(GND) C78.GND3(GND) C78.GND4(GND) C78.GND5(GND) C78.GND6(GND) C78.GND7(GND) C78.GND8(GND) C79.GND1(GND) C79.GND2(GND) C79.GND3(GND) C79.GND4(GND) C79.GND5(GND) C79.GND6(GND) C79.GND7(GND) C79.GND8(GND) LDO_4.4(GND) LDO_4.P1(GND) LDO_4.P2(GND) LDO_4.P3(GND) LDO_4.P4(GND) LDO_4.P5(GND) LDO_4.PAD(GND) LDO_5.4(GND) LDO_5.P1(GND) LDO_5.P2(GND) LDO_5.P3(GND) LDO_5.P4(GND) LDO_5.P5(GND) LDO_5.PAD(GND) LDO_6.4(GND) LDO_6.P1(GND) LDO_6.P2(GND) LDO_6.P3(GND) LDO_6.P4(GND) LDO_6.P5(GND) LDO_6.PAD(GND) LNA_4.2(GND) LNA_4.4(GND_1) LNA_5.2(GND) LNA_5.4(GND_1) LNA_6.2(GND) LNA_6.4(GND_1) R14.2 R19.2 R23.2 SAW_5.1(GND) SAW_5.3(GND_1) SAW_5.4(CASE_GND) SAW_5.5(GND_2) SAW_5.7(GND_3) SAW_5.8(CASE_GND_1) SAW_6.1(GND) SAW_6.3(GND_1) SAW_6.4(CASE_GND) SAW_6.5(GND_2) SAW_6.7(GND_3) SAW_6.8(CASE_GND_1) SAW_7.1(GND) SAW_7.3(GND_1) SAW_7.4(CASE_GND) SAW_7.5(GND_2) SAW_7.7(GND_3) SAW_7.8(CASE_GND_1) SAW_8.1(GND) SAW_8.3(GND_1) SAW_8.4(CASE_GND) SAW_8.5(GND_2) SAW_8.7(GND_3) SAW_8.8(CASE_GND_1) X9.2(GND) X10.2(GND) X11.2(GND) X12.2(GND) X13.2(GND) X14.2(GND) X15.2(GND) X16.2(GND) ; also sheet 1,2,3,5
LDO_4_5V: C15.1 C16.1 C67.2 C69.OUT L10.2 R12.1 TP_4.TP
LDO_5_5V: C19.1 C20.1 C71.2 C75.OUT L11.2 R16.1 TP_5.TP
LDO_6_5V: C23.1 C24.1 C77.2 C79.OUT L12.1 R22.1 TP_6.TP
LNA_4_IN: C14.2 LNA_4.3(RF_IN)
LNA_4_OUT: C17.1 L10.1 LNA_4.1(RF_OUT)
LNA_5_IN: C18.2 LNA_5.3(RF_IN)
LNA_5_OUT: C21.1 L11.1 LNA_5.1(RF_OUT)
LNA_6_IN: C22.2 LNA_6.3(RF_IN)
LNA_6_OUT: C25.1 L12.2 LNA_6.1(RF_OUT)
N$27: C67.1 LDO_4.3(FB/SNS) R12.2 R14.1
N$28: C66.1 LDO_4.6(NR)
N$30: C68.OUT LDO_4.7(IN) LDO_4.8(IN)
N$33: C69.IN LDO_4.1(OUT) LDO_4.2(OUT)
N$34: C71.1 LDO_5.3(FB/SNS) R16.2 R19.1
N$36: C70.1 LDO_5.6(NR)
N$38: C74.OUT LDO_5.7(IN) LDO_5.8(IN)
N$39: C75.IN LDO_5.1(OUT) LDO_5.2(OUT)
N$41: C77.1 LDO_6.3(FB/SNS) R22.2 R23.1
N$42: C76.1 LDO_6.6(NR)
N$43: C78.OUT LDO_6.7(IN) LDO_6.8(IN)
N$45: C79.IN LDO_6.1(OUT) LDO_6.2(OUT)
SAW+6_OUT: C22.1 SAW_6.6(OUTPUT) X13.1
SAW_5_IN: C17.2 SAW_5.2(INPUT) X10.1
SAW_5_OUT: C18.1 SAW_5.6(OUTPUT) X11.1
SAW_6_IN: C21.2 SAW_6.2(INPUT) X12.1
SAW_7_8_RF: SAW_7.6(OUTPUT) SAW_8.2(INPUT) X15.1
SAW_7_IN: C25.2 SAW_7.2(INPUT) X14.1

### Notes on the sheet
- REV B HAD PCHAN FET HERE
  GROUND GATE
- REV B HAD PCHAN FET HERE
  GROUND GATE
- +5V
- +5V
- PRESEL IN
  TO FILTERS
- PRESEL IN
  TO FILTERS
- REV B HAD PCHAN FET HERE
  GROUND GATE
- +5V
- 1.25m Band

## Sheet 5 of 5: 70cm Band
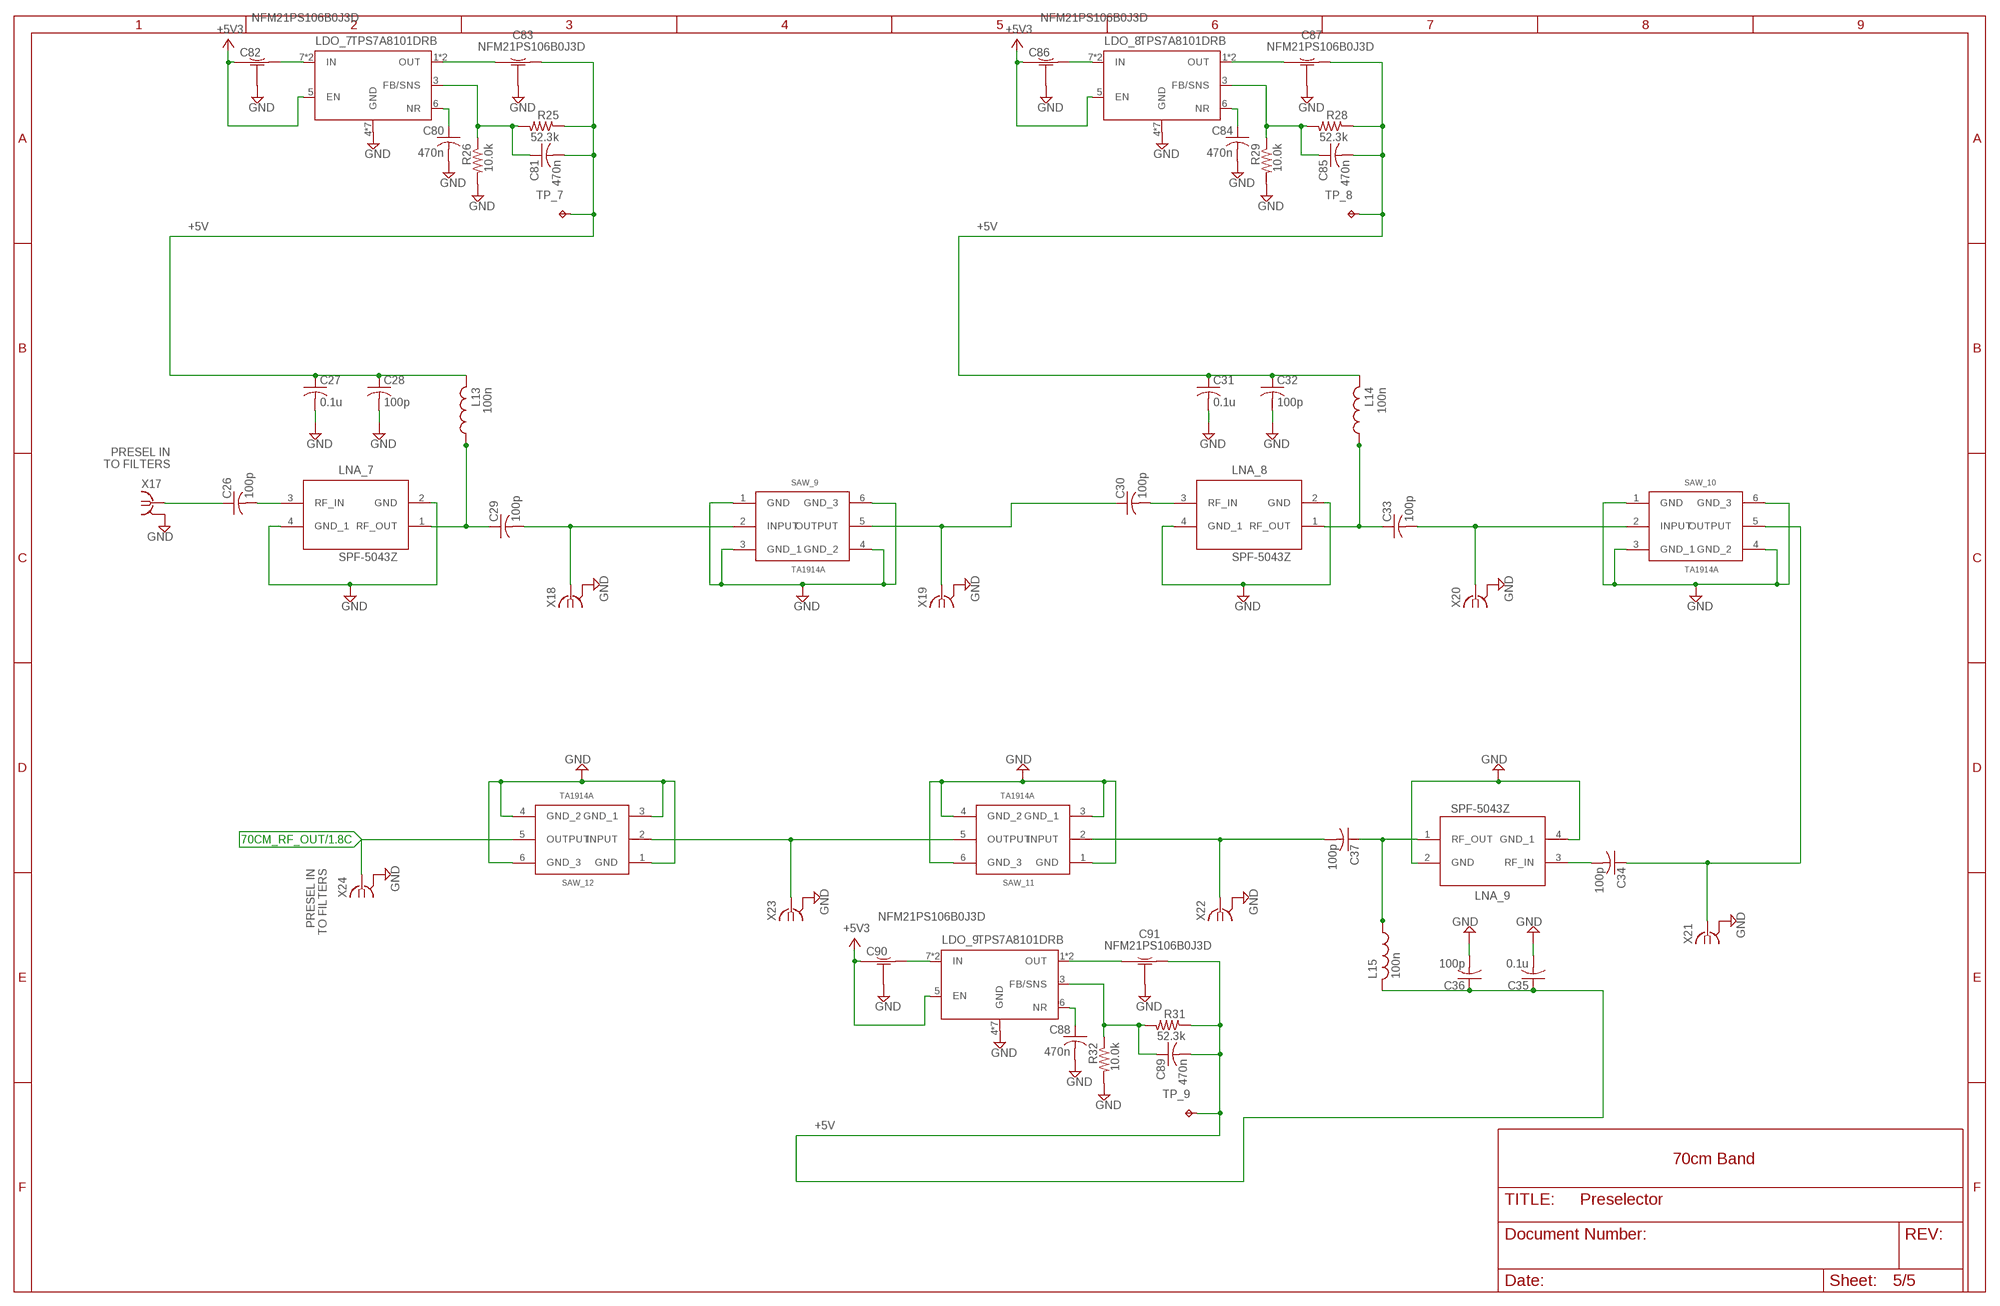
[diagram p4: schematic, sheet 5]

### Parts
C26  100p  C-USC0603K  [C0603K]
C27  0.1u  C-USC0603K  [C0603K]
C28  100p  C-USC0603K  [C0603K]
C29  100p  C-USC0603K  [C0603K]
C30  100p  C-USC0603K  [C0603K]
C31  0.1u  C-USC0603K  [C0603K]
C32  100p  C-USC0603K  [C0603K]
C33  100p  C-USC0603K  [C0603K]
C34  100p  C-USC0603K  [C0603K]
C35  0.1u  C-USC0603K  [C0603K]
C36  100p  C-USC0603K  [C0603K]
C37  100p  C-USC0603K  [C0603K]
C80  470n  C-USC0603K  [C0603K]
C81  470n  C-USC0603K  [C0603K]
C82  NFM21PS106B0J3D  NFM21PS  [NFM21PS]
C83  NFM21PS106B0J3D  NFM21PS  [NFM21PS]
C84  470n  C-USC0603K  [C0603K]
C85  470n  C-USC0603K  [C0603K]
C86  NFM21PS106B0J3D  NFM21PS  [NFM21PS]
C87  NFM21PS106B0J3D  NFM21PS  [NFM21PS]
C88  470n  C-USC0603K  [C0603K]
C89  470n  C-USC0603K  [C0603K]
C90  NFM21PS106B0J3D  NFM21PS  [NFM21PS]
C91  NFM21PS106B0J3D  NFM21PS  [NFM21PS]
L13  100n  L-US1206  [C1206]
L14  100n  L-US1206  [C1206]
L15  100n  L-US1206  [C1206]
LDO_7  TPS7A8101DRB  [DRB]
LDO_8  TPS7A8101DRB  [DRB]
LDO_9  TPS7A8101DRB  [DRB]
LNA_7  SPF-5043Z  [SPF-5043Z]
LNA_8  SPF-5043Z  [SPF-5043Z]
LNA_9  SPF-5043Z  [SPF-5043Z]
R25  52.3k  R-US_R0603  [R0603]
R26  10.0k  R-US_R0603  [R0603]
R28  52.3k  R-US_R0603  [R0603]
R29  10.0k  R-US_R0603  [R0603]
R31  52.3k  R-US_R0603  [R0603]
R32  10.0k  R-US_R0603  [R0603]
SAW_9  TA1914A  [TA1914A]
SAW_10  TA1914A  [TA1914A]
SAW_11  TA1914A  [TA1914A]
SAW_12  TA1914A  [TA1914A]
TP_7  TPTP20SQ  [TP20SQ]
TP_8  TPTP20SQ  [TP20SQ]
TP_9  TPTP20SQ  [TP20SQ]
X17  0733660061  BU-SMA-V  [BU-SMA-V]
X18  0733660061  BU-SMA-V  [BU-SMA-V]
X19  0733660061  BU-SMA-V  [BU-SMA-V]
X20  0733660061  BU-SMA-V  [BU-SMA-V]
X21  0733660061  BU-SMA-V  [BU-SMA-V]
X22  0733660061  BU-SMA-V  [BU-SMA-V]
X23  0733660061  BU-SMA-V  [BU-SMA-V]
X24  0733660061  BU-SMA-V  [BU-SMA-V]

### Nets
70CM_RF_IN [GND]: C26.1 X17.1
70CM_RF_OUT: SAW_12.5(OUTPUT) X24.1 ; also sheet 1
+5V3: C82.IN C86.IN C90.IN LDO_7.5(EN) LDO_8.5(EN) LDO_9.5(EN) ; also sheet 1,2,3,4
GND [GND]: C27.2 C28.2 C31.2 C32.2 C35.2 C36.2 C80.2 C82.GND1(GND) C82.GND2(GND) C82.GND3(GND) C82.GND4(GND) C82.GND5(GND) C82.GND6(GND) C82.GND7(GND) C82.GND8(GND) C83.GND1(GND) C83.GND2(GND) C83.GND3(GND) C83.GND4(GND) C83.GND5(GND) C83.GND6(GND) C83.GND7(GND) C83.GND8(GND) C84.2 C86.GND1(GND) C86.GND2(GND) C86.GND3(GND) C86.GND4(GND) C86.GND5(GND) C86.GND6(GND) C86.GND7(GND) C86.GND8(GND) C87.GND1(GND) C87.GND2(GND) C87.GND3(GND) C87.GND4(GND) C87.GND5(GND) C87.GND6(GND) C87.GND7(GND) C87.GND8(GND) C88.2 C90.GND1(GND) C90.GND2(GND) C90.GND3(GND) C90.GND4(GND) C90.GND5(GND) C90.GND6(GND) C90.GND7(GND) C90.GND8(GND) C91.GND1(GND) C91.GND2(GND) C91.GND3(GND) C91.GND4(GND) C91.GND5(GND) C91.GND6(GND) C91.GND7(GND) C91.GND8(GND) LDO_7.4(GND) LDO_7.P1(GND) LDO_7.P2(GND) LDO_7.P3(GND) LDO_7.P4(GND) LDO_7.P5(GND) LDO_7.PAD(GND) LDO_8.4(GND) LDO_8.P1(GND) LDO_8.P2(GND) LDO_8.P3(GND) LDO_8.P4(GND) LDO_8.P5(GND) LDO_8.PAD(GND) LDO_9.4(GND) LDO_9.P1(GND) LDO_9.P2(GND) LDO_9.P3(GND) LDO_9.P4(GND) LDO_9.P5(GND) LDO_9.PAD(GND) LNA_7.2(GND) LNA_7.4(GND_1) LNA_8.2(GND) LNA_8.4(GND_1) LNA_9.2(GND) LNA_9.4(GND_1) R26.2 R29.2 R32.2 SAW_9.1(GND) SAW_9.3(GND_1) SAW_9.4(GND_2) SAW_9.6(GND_3) SAW_10.1(GND) SAW_10.3(GND_1) SAW_10.4(GND_2) SAW_10.6(GND_3) SAW_11.1(GND) SAW_11.3(GND_1) SAW_11.4(GND_2) SAW_11.6(GND_3) SAW_12.1(GND) SAW_12.3(GND_1) SAW_12.4(GND_2) SAW_12.6(GND_3) X17.2(GND) X18.2(GND) X19.2(GND) X20.2(GND) X21.2(GND) X22.2(GND) X23.2(GND) X24.2(GND) ; also sheet 1,2,3,4
LDO_7_5V: C27.1 C28.1 C81.2 C83.OUT L13.2 R25.1 TP_7.TP
LDO_8_5V: C31.1 C32.1 C85.2 C87.OUT L14.2 R28.1 TP_8.TP
LDO_9_5V: C35.1 C36.1 C89.2 C91.OUT L15.2 R31.1 TP_9.TP
LNA_7_IN: C26.2 LNA_7.3(RF_IN)
LNA_7_OUT [GND]: C29.1 L13.1 LNA_7.1(RF_OUT)
LNA_8_IN: C30.2 LNA_8.3(RF_IN)
LNA_8_OUT [GND]: C33.1 L14.1 LNA_8.1(RF_OUT)
LNA_9_IN: C34.2 LNA_9.3(RF_IN)
LNA_9_OUT [GND]: C37.1 L15.1 LNA_9.1(RF_OUT)
N$40: C81.1 LDO_7.3(FB/SNS) R25.2 R26.1
N$46: C80.1 LDO_7.6(NR)
N$47: C82.OUT LDO_7.7(IN) LDO_7.8(IN)
N$48: C83.IN LDO_7.1(OUT) LDO_7.2(OUT)
N$49: C85.1 LDO_8.3(FB/SNS) R28.2 R29.1
N$50: C84.1 LDO_8.6(NR)
N$51: C86.OUT LDO_8.7(IN) LDO_8.8(IN)
N$52: C87.IN LDO_8.1(OUT) LDO_8.2(OUT)
N$53: C89.1 LDO_9.3(FB/SNS) R31.2 R32.1
N$54: C88.1 LDO_9.6(NR)
N$56: C90.OUT LDO_9.7(IN) LDO_9.8(IN)
N$57: C91.IN LDO_9.1(OUT) LDO_9.2(OUT)
SAW_9_IN: C29.2 SAW_9.2(INPUT) X18.1
SAW_9_OUT: C30.1 SAW_9.5(OUTPUT) X19.1
SAW_10_IN: C33.2 SAW_10.2(INPUT) X20.1
SAW_10_OUT: C34.1 SAW_10.5(OUTPUT) X21.1
SAW_11_12_RF: SAW_11.5(OUTPUT) SAW_12.2(INPUT) X23.1
SAW_11_IN: C37.2 SAW_11.2(INPUT) X22.1

### Notes on the sheet
- +5V | +5V
- PRESEL IN
  TO FILTERS
- PRESEL IN
  TO FILTERS
- +5V
- 70cm Band

## Power pins joined to a net without a drawn wire
GND: X1.3(GND) X1.4(GND) X1.5(GND) X2.3(GND) X2.4(GND) X2.5(GND) X3.3(GND) X3.4(GND) X3.5(GND) X4.3(GND) X4.4(GND) X4.5(GND) X5.3(GND) X5.4(GND) X5.5(GND) X6.3(GND) X6.4(GND) X6.5(GND) X7.3(GND) X7.4(GND) X7.5(GND) X8.3(GND) X8.4(GND) X8.5(GND) X9.3(GND) X9.4(GND) X9.5(GND) X10.3(GND) X10.4(GND) X10.5(GND) X11.3(GND) X11.4(GND) X11.5(GND) X12.3(GND) X12.4(GND) X12.5(GND) X13.3(GND) X13.4(GND) X13.5(GND) X14.3(GND) X14.4(GND) X14.5(GND) X15.3(GND) X15.4(GND) X15.5(GND) X16.3(GND) X16.4(GND) X16.5(GND) X17.3(GND) X17.4(GND) X17.5(GND) X18.3(GND) X18.4(GND) X18.5(GND) X19.3(GND) X19.4(GND) X19.5(GND) X20.3(GND) X20.4(GND) X20.5(GND) X21.3(GND) X21.4(GND) X21.5(GND) X22.3(GND) X22.4(GND) X22.5(GND) X23.3(GND) X23.4(GND) X23.5(GND) X24.3(GND) X24.4(GND) X24.5(GND) X25.3(GND) X25.4(GND) X25.5(GND) X26.3(GND) X26.4(GND) X26.5(GND) X27.3(GND) X27.4(GND) X27.5(GND) X28.3(GND) X28.4(GND) X28.5(GND) X29.3(GND) X29.4(GND) X29.5(GND) X30.3(GND) X30.4(GND) X30.5(GND) X33.3(GND) X33.4(GND) X33.5(GND)

## Library data of the parts
C1-C54 C57-C59 C62 C63 C66 C67 C70-C73 C76 C77 C80 C81 C84 C85 C88 C89 C92 C93 C96 C97 C100-C110 C481 C482 C489-C493 = rcl:C-US: CAPACITOR, American symbol
C55 C56 C60 C61 C64 C65 C68 C69 C74 C75 C78 C79 C82 C83 C86 C87 C90 C91 C94 C95 C98 C99 = DEEP EDDY:NFM21PS
C459 = DEEP EDDY:NFM31PC276B0J3L
C483 C484 = rcl:CPOL-US: POLARIZED CAPACITOR, American symbol; PN: EEE-FK1V470P
C500 = NewSDR:NFM41P*: Murata Feed Through Capacitor 1806 SMD; CURRENT: 6A; VALUE: 1.5uF; VOLATAGE: 25VDC
IC1 = SeniorDesign:SCA-4-10+: Surface Mount Power Splitter/Combiner Source: Datasheet <https://ww3.minicircuits.com/pdfs/SCA-4-10 .pdf>; DESCRIPTION: Surface Mount Power Splitter/Combiner; HEIGHT: 4.83mm; MANUFACTURER_NAME: Mini-Circuits; MANUFACTURER_PART_NUMBER: SCA-4-10+
IC58 = DEEP EDDY:LMZ31707
J1 = con-molex:22-?-02: CONNECTOR wire to board 2.54 mm (.1 inch) pitch header; OC_FARNELL: unknown; OC_NEWARK: unknown
L1-L30 L32 L33 = NewSDR:L-US: SMD Chip Inductor
L31 = wuerth-elektronik:WE-CBF: SMD EMI Suppression Ferrite Beads - excellent anti-EMI properties - low DCR - impedances till 3000 ohms - rated current up to 6 A; INDUCTANCE: 32u
LDO_1-LDO_11 = DEEP EDDY:TPS7A8101
LED1 = led:LED: LED OSRAM: - CHIPLED LG R971, LG N971, LY N971, LG Q971, LY Q971, LO R971, LY R971 LH N974, LH R974 LS Q976, LO Q976, LY Q976 LO Q996 - Hyper CHIPLED LW Q18S LB Q993, LB Q99A, LB R99A - SideLED LS A670, LO A670, LY A670, LG A670, LP A670 LB A673, LV A673, LT A673, LW A673 LH A674 LY A675 LS A676, LA A676, LO A676, LY A676, LW A676 LS A679, LY A679, LG A679 - Hyper Micro SIDELED® LS Y876, LA Y876, LO Y876, LY Y876 LT Y87S - SmartLED LW L88C, LW L88S LB L89C, LB L89S, LG L890 LS L89K, LO L89K, LY L89K LS L896, LA L896, LO L896, LY L896 - TOPLED LS T670, LO T670, LY T670, LG T670, LP T670 LSG T670, LSP T670, LSY T670, LOP T670, LYG T670 LG T671, LOG T671, LSG T671 LB T673, LV T673, LT T673, LW T673 LH T674 LS T676, LA T676, LO T676, LY T676, LB T676, LH T676, LSB T676, LW T676 LB T67C, LV T67C, LT T67C, LS T67K, LO T67K, LY T67K, LW E67C LS E67B, LA E67B, LO E67B, LY E67B, LB E67C, LV E67C, LT E67C LW T67C LS T679, LY T679, LG T679 LS T770, LO T770, LY T770, LG T770, LP T770 LB T773, LV T773, LT T773, LW T773 LH T774 LS E675, LA E675, LY E675, LS T675 LS T776, LA T776, LO T776, LY T776, LB T776 LHGB T686 LT T68C, LB T68C - Hyper Mini TOPLED® LB M676 - Mini TOPLED Santana® LG M470 LS M47K, LO M47K, LY M47K Source: http://www.osram.convergy.de LUXEON: - LUMILED® LXK2-PW12-R00, LXK2-PW12-S00, LXK2-PW14-U00, LXK2-PW14-V00 LXK2-PM12-R00, LXK2-PM12-S00, LXK2-PM14-U00 LXK2-PE12-Q00, LXK2-PE12-R00, LXK2-PE12-S00, LXK2-PE14-T00, LXK2-PE14-U00 LXK2-PB12-K00, LXK2-PB12-L00, LXK2-PB12-M00, LXK2-PB14-N00, LXK2-PB14-P00, LXK2-PB14-Q00 LXK2-PR12-L00, LXK2-PR12-M00, LXK2-PR14-Q00, LXK2-PR14-R00 LXK2-PD12-Q00, LXK2-PD12-R00, LXK2-PD12-S00 LXK2-PH12-R00, LXK2-PH12-S00 LXK2-PL12-P00, LXK2-PL12-Q00, LXK2-PL12-R00 Source: www.luxeon.com KINGBRIGHT: KA-3528ASYC Source: www.kingbright.com
LNA_1-LNA_11 = SeniorDesign:SPF-5043Z: SPF-5043Z - 40 - 4000 MHZ LNA Technical Specifications: VCC: 4.75-5.25V Operating Temperature: -40°C to 85°C Gain/NF @70MHz: 20dB/0.6dB Gain/NF @140MHz: 23.5dB/0.6dB Gain/NF @225MHz: 23.5dB/0.6dB Gain/NF @440MHz: 21.7dB/0.6dB Qorvo: SPF-5043Z 500 - 999 @$1.34ea
R1-R17 R19 R22 R23 R25 R26 R28 R29 R31 R32 R34 R35 R37 R38 R201 R205 R206 = rcl:R-US_: RESISTOR, American symbol
SAW_1 = SeniorDesign:SXBP-140+
SAW_2-SAW_4 = SeniorDesign:TA147FD
SAW_5-SAW_8 = SeniorDesign:TA0576A: SAW Filter 221.6 MHz SMD 5.0x5.0mm Source: Datasheet <https://www.taisaw.com/upload/product/TA0576A _Rev 2.0_.pdf>; DESCRIPTION: SAW Filter 221.6 MHz SMD 5.0x5.0mm; HEIGHT: 1.7mm; MANUFACTURER_NAME: TAI-SAW Technology; MANUFACTURER_PART_NUMBER: TA0576A
SAW_9-SAW_12 = SeniorDesign:TA1914A: TA1914A - 440MHz SAW Filter Technical Specifications: Max RF Power: 10dBm Operating Temperature: -30°C to 60°C Insertion Loss: 2dB Passband: 420-446 MHz
TP10 = testpad:TPSQ: Test pad
TP_1-TP_11 = testpad:TP: Test pad
X1-X30 X33 = con-coax:BU-SMA-V: FEMALE SMA CONNECTOR Radiall distributor RS 112-3794

## Net classes
0 default: width 0.102 mm, drill 0.203 mm, clearance 0.102 mm
1 GND: width 0.203 mm, drill 0.229 mm, clearance 0.203 mm to class 0, clearance 0.203 mm